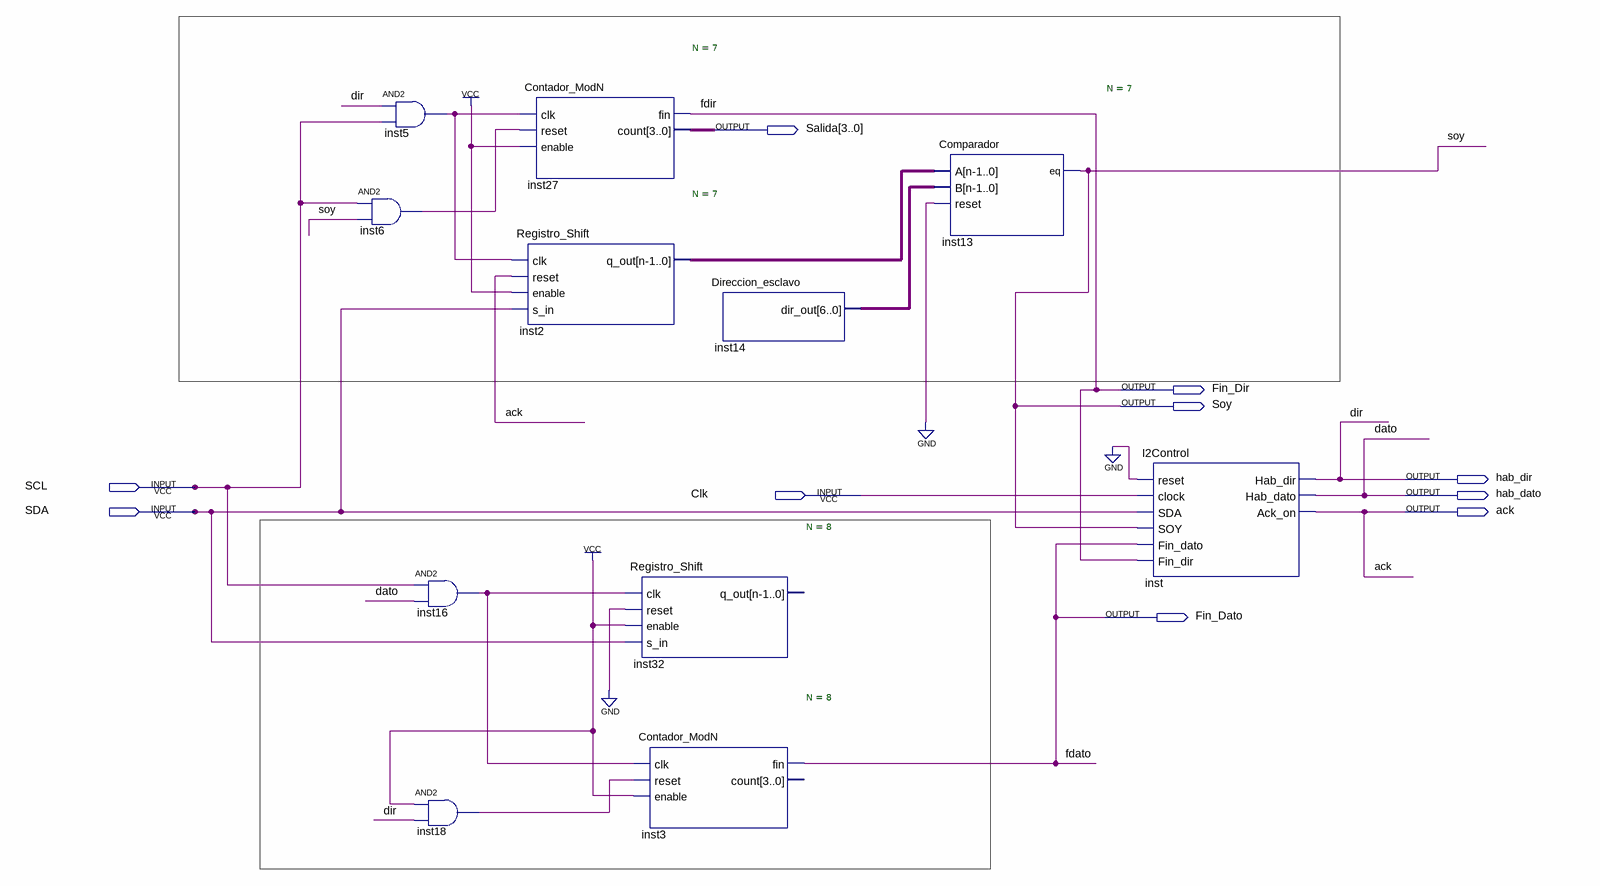
[diagram p0: schematic sheet]
// Quartus schematic ParteF.bdf as structural Verilog: 11 symbols, 10 pins
module ParteF (
  input  SCL,
  input  Clk,
  input  SDA,
  output [3:0] Salida,
  output Fin_Dir,
  output Soy,
  output hab_dir,
  output hab_dato,
  output ack,
  output Fin_Dato
);

  wire inst5_out, inst6_out, inst16_out, inst18_out;
  wire [6:0] inst2_q_out, inst14_dir_out;

  and inst5 (inst5_out, hab_dir, SCL);
  and inst6 (inst6_out, SCL, Soy);
  and inst16 (inst16_out, SCL, hab_dato);
  and inst18 (inst18_out, 1'b1, hab_dir);
  Registro_Shift #(.N(7)) inst2 (.clk(inst5_out), .reset(ack), .enable(1'b1), .s_in(SDA), .q_out(inst2_q_out));
  Contador_ModN #(.N(7)) inst27 (.clk(inst5_out), .reset(inst6_out), .enable(1'b1), .fin(Fin_Dir), .count(Salida));
  Registro_Shift #(.N(8)) inst32 (.clk(inst16_out), .reset(1'b0), .enable(1'b1), .s_in(SDA));  // open: q_out
  Contador_ModN #(.N(8)) inst3 (.clk(inst16_out), .reset(inst18_out), .enable(1'b1), .fin(Fin_Dato));  // open: count
  Direccion_esclavo inst14 (.dir_out(inst14_dir_out));
  Comparador #(.N(7)) inst13 (.A(inst2_q_out), .B(inst14_dir_out), .reset(1'b0), .eq(Soy));
  I2Control inst (
    .reset(1'b0), .clock(Clk), .SDA(SDA), .SOY(Soy), .Fin_dato(Fin_Dato), .Fin_dir(Fin_Dir),
    .Hab_dir(hab_dir), .Hab_dato(hab_dato), .Ack_on(ack));

  // Other names for the same wires on the sheet: dato = hab_dato; dir = hab_dir; fdir = Fin_Dir; fdato = Fin_Dato
endmodule
